# Altium project W5100S-PICO-Mining.PrjPcb
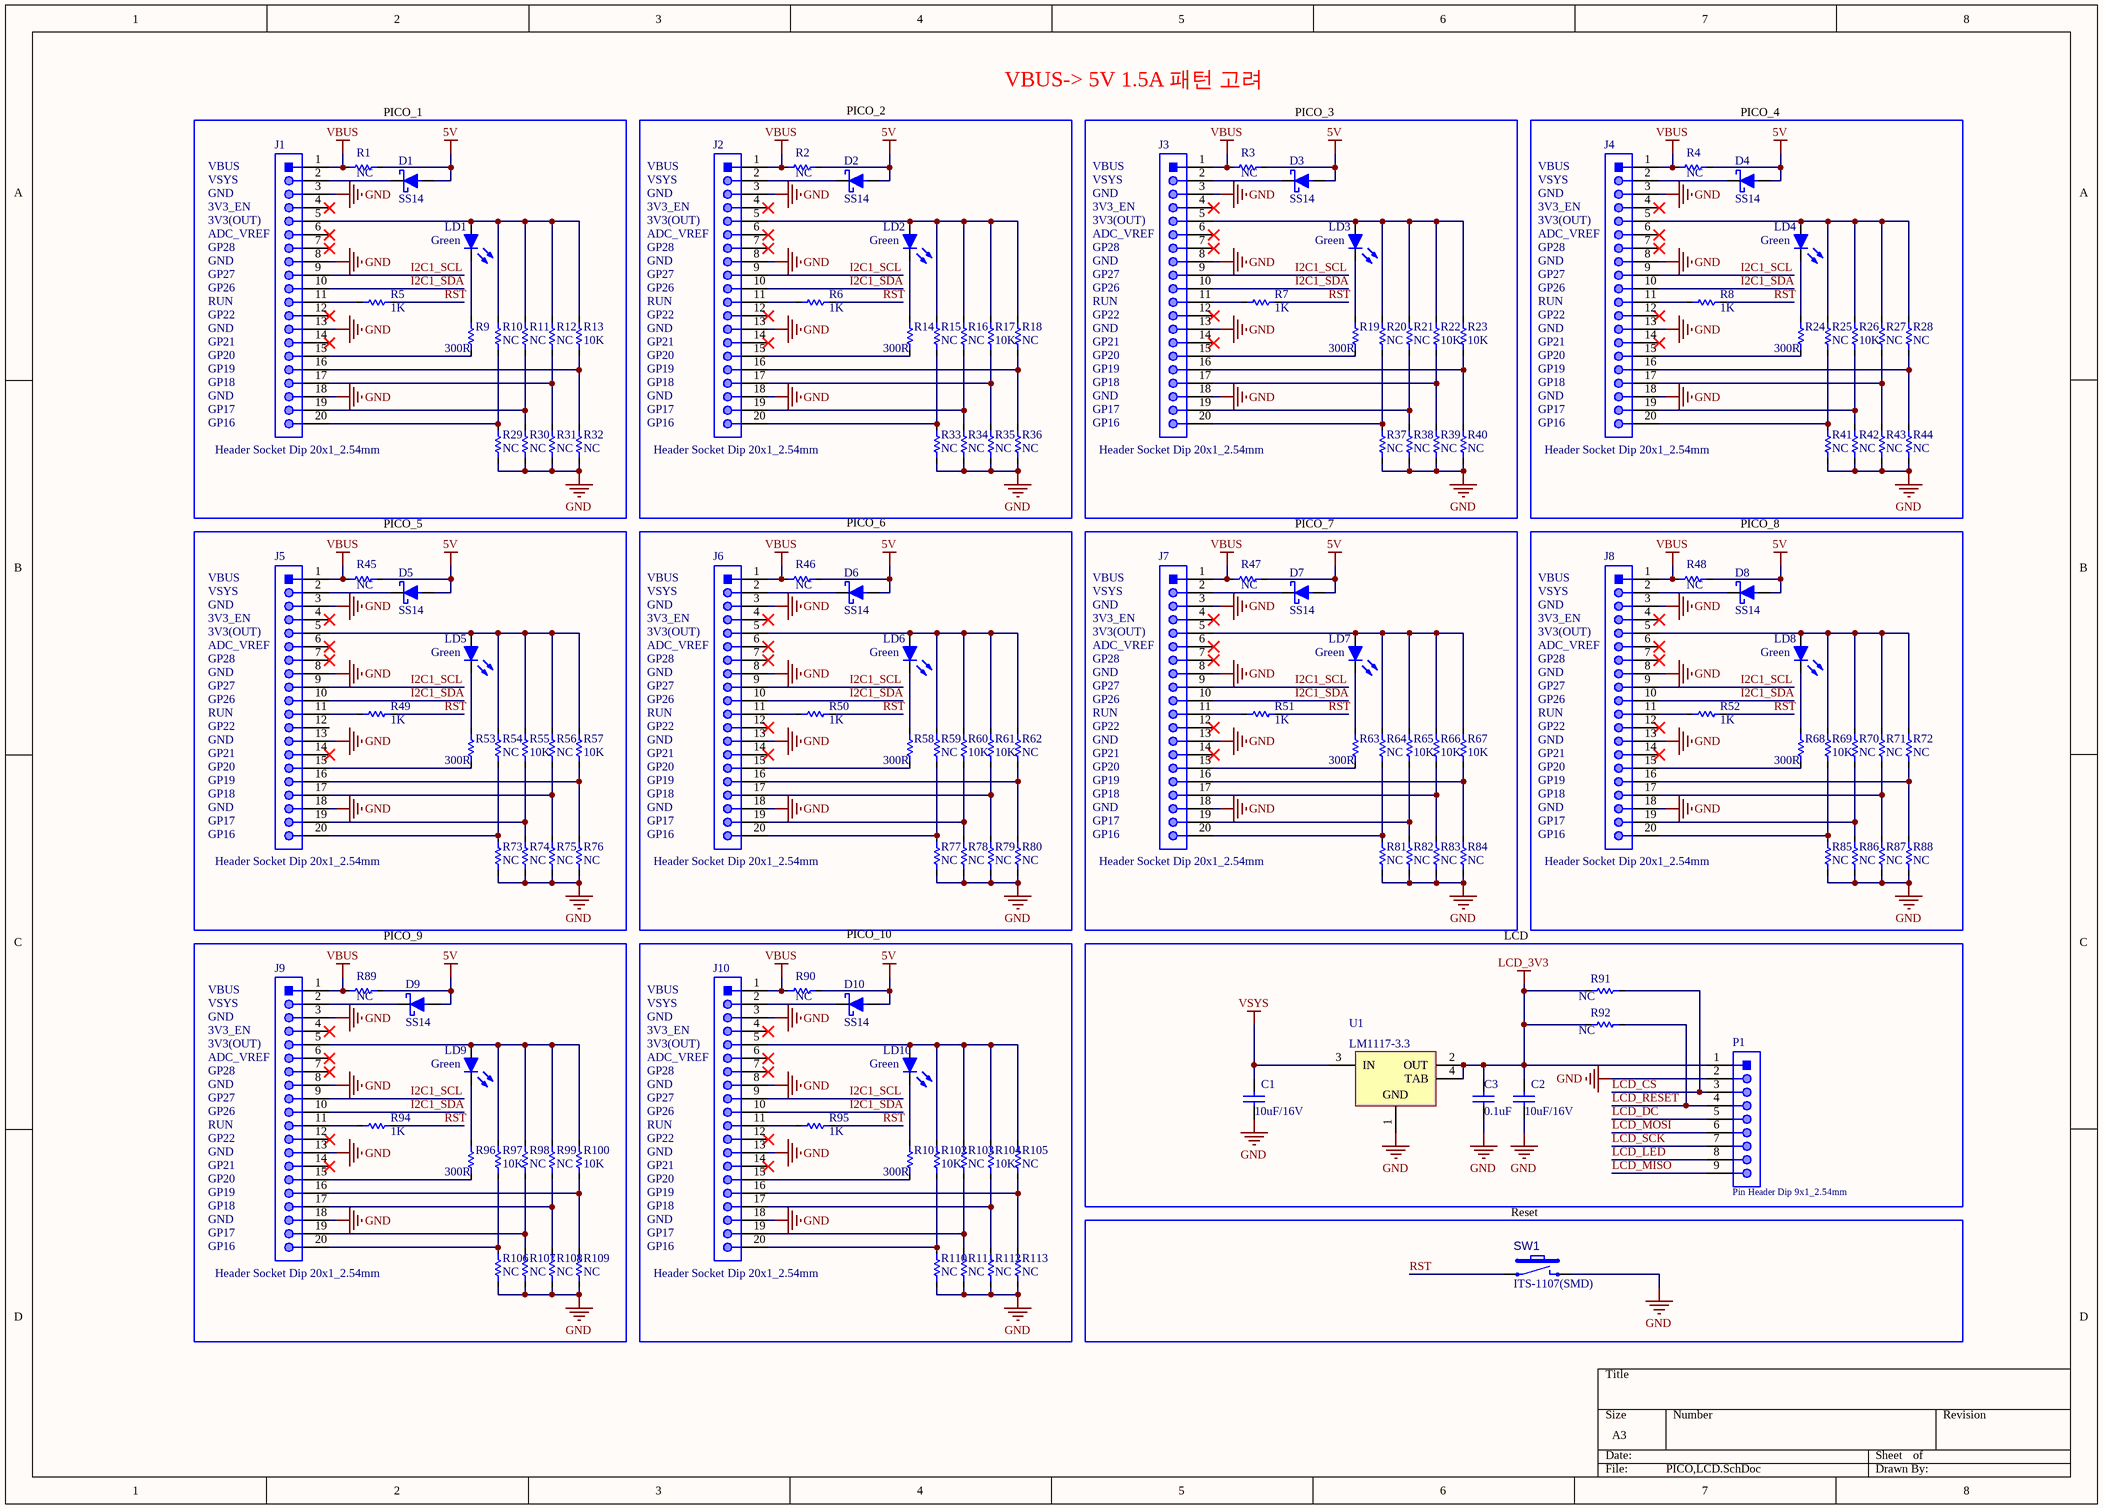
[diagram p0: PICO,LCD.SchDoc]
2 sheets, 224 parts. Net scope: global (net labels, ports and power ports of the same name join across sheets).
Board file: W5100S-PICO-Mining_V100.PcbDoc
Sheets:
  PICO,LCD.SchDoc
  W5100S+POE.SchDoc

## Sheet PICO,LCD.SchDoc
size A3; SheetNumber: 1; SheetTotal: 2

### Parts
C1  10uF/16V  [CAP-0805]
C2  10uF/16V  [CAP-0805]
C3  0.1uF  [CAP-0603]
D1  SS14  [DO-214AC/SMA]
D2  SS14  [DO-214AC/SMA]
D3  SS14  [DO-214AC/SMA]
D4  SS14  [DO-214AC/SMA]
D5  SS14  [DO-214AC/SMA]
D6  SS14  [DO-214AC/SMA]
D7  SS14  [DO-214AC/SMA]
D8  SS14  [DO-214AC/SMA]
D9  SS14  [DO-214AC/SMA]
D10  SS14  [DO-214AC/SMA]
J1  Header Socket Dip 20x1_2.54mm  [IDC-1X20(SOCKET)]
J2  Header Socket Dip 20x1_2.54mm  [IDC-1X20(SOCKET)]
J3  Header Socket Dip 20x1_2.54mm  [IDC-1X20(SOCKET)]
J4  Header Socket Dip 20x1_2.54mm  [IDC-1X20(SOCKET)]
J5  Header Socket Dip 20x1_2.54mm  [IDC-1X20(SOCKET)]
J6  Header Socket Dip 20x1_2.54mm  [IDC-1X20(SOCKET)]
J7  Header Socket Dip 20x1_2.54mm  [IDC-1X20(SOCKET)]
J8  Header Socket Dip 20x1_2.54mm  [IDC-1X20(SOCKET)]
J9  Header Socket Dip 20x1_2.54mm  [IDC-1X20(SOCKET)]
J10  Header Socket Dip 20x1_2.54mm  [IDC-1X20(SOCKET)]
LD1  Green  [LED-0603-GREEN]
LD2  Green  [LED-0603-GREEN]
LD3  Green  [LED-0603-GREEN]
LD4  Green  [LED-0603-GREEN]
LD5  Green  [LED-0603-GREEN]
LD6  Green  [LED-0603-GREEN]
LD7  Green  [LED-0603-GREEN]
LD8  Green  [LED-0603-GREEN]
LD9  Green  [LED-0603-GREEN]
LD10  Green  [LED-0603-GREEN]
P1  Pin Header Dip 9x1_2.54mm  [LCD(PIN HEADER9X1_2.54)]
R1  NC  [RES-0603]
R2  NC  [RES-0603]
R3  NC  [RES-0603]
R4  NC  [RES-0603]
R5  1K  [RES-0603]
R6  1K  [RES-0603]
R7  1K  [RES-0603]
R8  1K  [RES-0603]
R9  300R  [RES-0603]
R10  NC  [RES-0603]
R11  NC  [RES-0603]
R12  NC  [RES-0603]
R13  10K  [RES-0603]
R14  300R  [RES-0603]
R15  NC  [RES-0603]
R16  NC  [RES-0603]
R17  10K  [RES-0603]
R18  NC  [RES-0603]
R19  300R  [RES-0603]
R20  NC  [RES-0603]
R21  NC  [RES-0603]
R22  10K  [RES-0603]
R23  10K  [RES-0603]
R24  300R  [RES-0603]
R25  NC  [RES-0603]
R26  10K  [RES-0603]
R27  NC  [RES-0603]
R28  NC  [RES-0603]
R29  NC  [RES-0603]
R30  NC  [RES-0603]
R31  NC  [RES-0603]
R32  NC  [RES-0603]
R33  NC  [RES-0603]
R34  NC  [RES-0603]
R35  NC  [RES-0603]
R36  NC  [RES-0603]
R37  NC  [RES-0603]
R38  NC  [RES-0603]
R39  NC  [RES-0603]
R40  NC  [RES-0603]
R41  NC  [RES-0603]
R42  NC  [RES-0603]
R43  NC  [RES-0603]
R44  NC  [RES-0603]
R45  NC  [RES-0603]
R46  NC  [RES-0603]
R47  NC  [RES-0603]
R48  NC  [RES-0603]
R49  1K  [RES-0603]
R50  1K  [RES-0603]
R51  1K  [RES-0603]
R52  1K  [RES-0603]
R53  300R  [RES-0603]
R54  NC  [RES-0603]
R55  10K  [RES-0603]
R56  NC  [RES-0603]
R57  10K  [RES-0603]
R58  300R  [RES-0603]
R59  NC  [RES-0603]
R60  10K  [RES-0603]
R61  10K  [RES-0603]
R62  NC  [RES-0603]
R63  300R  [RES-0603]
R64  NC  [RES-0603]
R65  10K  [RES-0603]
R66  10K  [RES-0603]
R67  10K  [RES-0603]
R68  300R  [RES-0603]
R69  10K  [RES-0603]
R70  NC  [RES-0603]
R71  NC  [RES-0603]
R72  NC  [RES-0603]
R73  NC  [RES-0603]
R74  NC  [RES-0603]
R75  NC  [RES-0603]
R76  NC  [RES-0603]
R77  NC  [RES-0603]
R78  NC  [RES-0603]
R79  NC  [RES-0603]
R80  NC  [RES-0603]
R81  NC  [RES-0603]
R82  NC  [RES-0603]
R83  NC  [RES-0603]
R84  NC  [RES-0603]
R85  NC  [RES-0603]
R86  NC  [RES-0603]
R87  NC  [RES-0603]
R88  NC  [RES-0603]
R89  NC  [RES-0603]
R90  NC  [RES-0603]
R91  NC  [RES-0603]
R92  NC  [RES-0603]
R94  1K  [RES-0603]
R95  1K  [RES-0603]
R96  300R  [RES-0603]
R97  10K  [RES-0603]
R98  NC  [RES-0603]
R99  NC  [RES-0603]
R100  10K  [RES-0603]
R101  300R  [RES-0603]
R102  10K  [RES-0603]
R103  NC  [RES-0603]
R104  10K  [RES-0603]
R105  NC  [RES-0603]
R106  NC  [RES-0603]
R107  NC  [RES-0603]
R108  NC  [RES-0603]
R109  NC  [RES-0603]
R110  NC  [RES-0603]
R111  NC  [RES-0603]
R112  NC  [RES-0603]
R113  NC  [RES-0603]
SW1  ITS-1107(SMD)  [IT-1107(SMD)]
U1  LM1117-3.3  [SOT-223]

### Blocks framed on the sheet
LCD: C1-C3 P1 R91 R92 U1
Reset: SW1

### Nets
5V: D1.1(A) D2.1(A) D3.1(A) D4.1(A) D5.1(A) D6.1(A) D7.1(A) D8.1(A) D9.1(A) D10.1(A) R1.1 R2.1 R3.1 R4.1 R45.1 R46.1 R47.1 R48.1 R89.1 R90.1
GND: C1.1 C2.1 C3.1 J1.3 J1.8 J1.13 J1.18 J2.3 J2.8 J2.13 J2.18 J3.3 J3.8 J3.13 J3.18 J4.3 J4.8 J4.13 J4.18 J5.3 J5.8 J5.13 J5.18 J6.3 J6.8 J6.13 J6.18 J7.3 J7.8 J7.13 J7.18 J8.3 J8.8 J8.13 J8.18 J9.3 J9.8 J9.13 J9.18 J10.3 J10.8 J10.13 J10.18 P1.2 R29.1 R30.1 R31.1 R32.1 R33.1 R34.1 R35.1 R36.1 R37.1 R38.1 R39.1 R40.1 R41.1 R42.1 R43.1 R44.1 R73.1 R74.1 R75.1 R76.1 R77.1 R78.1 R79.1 R80.1 R81.1 R82.1 R83.1 R84.1 R85.1 R86.1 R87.1 R88.1 R106.1 R107.1 R108.1 R109.1 R110.1 R111.1 R112.1 R113.1 SW1.2 U1.1(GND)
LCD_3V3: C2.2 C3.2 P1.1 R91.2 R92.2 U1.2(OUT) U1.4(TAB)
VBUS: J1.1 J2.1 J3.1 J4.1 J5.1 J6.1 J7.1 J8.1 J9.1 J10.1 R1.2 R2.2 R3.2 R4.2 R45.2 R46.2 R47.2 R48.2 R89.2 R90.2
VSYS: C1.2 U1.3(IN)
I2C1_SCL: J1.9 J2.9 J3.9 J4.9 J5.9 J6.9 J7.9 J8.9 J9.9 J10.9  [project net GPIO27/ADC1]
I2C1_SDA: J1.10 J2.10 J3.10 J4.10 J5.10 J6.10 J7.10 J8.10 J9.10 J10.10  [project net GPIO26/ADC0]
LCD_CS: P1.3 R91.1  [project net GPIO13]
LCD_DC: P1.5  [project net GPIO14]
LCD_LED: P1.8  [project net GPIO5]
LCD_MISO: P1.9  [project net GPIO12]
LCD_MOSI: P1.6  [project net GPIO11]
LCD_RESET: P1.4 R92.1  [project net GPIO15]
LCD_SCK: P1.7  [project net GPIO10]
RST: R5.1 R6.1 R7.1 R8.1 R49.1 R50.1 R51.1 R52.1 R94.1 R95.1 SW1.1
NetD1_2: D1.2(C) J1.2
NetD2_2: D2.2(C) J2.2
NetD3_2: D3.2(C) J3.2
NetD4_2: D4.2(C) J4.2
NetD5_2: D5.2(C) J5.2
NetD6_2: D6.2(C) J6.2
NetD7_2: D7.2(C) J7.2
NetD8_2: D8.2(C) J8.2
NetD9_2: D9.2(C) J9.2
NetD10_2: D10.2(C) J10.2
NetJ1_5: J1.5 LD1.1(A) R10.2 R11.2 R12.2 R13.2
NetJ1_11: J1.11 R5.2
NetJ1_15: J1.15 R9.2
NetJ1_16: J1.16 R13.1 R32.2
NetJ1_17: J1.17 R12.1 R31.2
NetJ1_19: J1.19 R11.1 R30.2
NetJ1_20: J1.20 R10.1 R29.2
NetJ2_5: J2.5 LD2.1(A) R15.2 R16.2 R17.2 R18.2
NetJ2_11: J2.11 R6.2
NetJ2_15: J2.15 R14.2
NetJ2_16: J2.16 R18.1 R36.2
NetJ2_17: J2.17 R17.1 R35.2
NetJ2_19: J2.19 R16.1 R34.2
NetJ2_20: J2.20 R15.1 R33.2
NetJ3_5: J3.5 LD3.1(A) R20.2 R21.2 R22.2 R23.2
NetJ3_11: J3.11 R7.2
NetJ3_15: J3.15 R19.2
NetJ3_16: J3.16 R23.1 R40.2
NetJ3_17: J3.17 R22.1 R39.2
NetJ3_19: J3.19 R21.1 R38.2
NetJ3_20: J3.20 R20.1 R37.2
NetJ4_5: J4.5 LD4.1(A) R25.2 R26.2 R27.2 R28.2
NetJ4_11: J4.11 R8.2
NetJ4_15: J4.15 R24.2
NetJ4_16: J4.16 R28.1 R44.2
NetJ4_17: J4.17 R27.1 R43.2
NetJ4_19: J4.19 R26.1 R42.2
NetJ4_20: J4.20 R25.1 R41.2
NetJ5_5: J5.5 LD5.1(A) R54.2 R55.2 R56.2 R57.2
NetJ5_11: J5.11 R49.2
NetJ5_15: J5.15 R53.2
NetJ5_16: J5.16 R57.1 R76.2
NetJ5_17: J5.17 R56.1 R75.2
NetJ5_19: J5.19 R55.1 R74.2
NetJ5_20: J5.20 R54.1 R73.2
NetJ6_5: J6.5 LD6.1(A) R59.2 R60.2 R61.2 R62.2
NetJ6_11: J6.11 R50.2
NetJ6_15: J6.15 R58.2
NetJ6_16: J6.16 R62.1 R80.2
NetJ6_17: J6.17 R61.1 R79.2
NetJ6_19: J6.19 R60.1 R78.2
NetJ6_20: J6.20 R59.1 R77.2
NetJ7_5: J7.5 LD7.1(A) R64.2 R65.2 R66.2 R67.2
NetJ7_11: J7.11 R51.2
NetJ7_15: J7.15 R63.2
NetJ7_16: J7.16 R67.1 R84.2
NetJ7_17: J7.17 R66.1 R83.2
NetJ7_19: J7.19 R65.1 R82.2
NetJ7_20: J7.20 R64.1 R81.2
NetJ8_5: J8.5 LD8.1(A) R69.2 R70.2 R71.2 R72.2
NetJ8_11: J8.11 R52.2
NetJ8_15: J8.15 R68.2
NetJ8_16: J8.16 R72.1 R88.2
NetJ8_17: J8.17 R71.1 R87.2
NetJ8_19: J8.19 R70.1 R86.2
NetJ8_20: J8.20 R69.1 R85.2
NetJ9_5: J9.5 LD9.1(A) R97.2 R98.2 R99.2 R100.2
NetJ9_11: J9.11 R94.2
NetJ9_15: J9.15 R96.2
NetJ9_16: J9.16 R100.1 R109.2
NetJ9_17: J9.17 R99.1 R108.2
NetJ9_19: J9.19 R98.1 R107.2
NetJ9_20: J9.20 R97.1 R106.2
NetJ10_5: J10.5 LD10.1(A) R102.2 R103.2 R104.2 R105.2
NetJ10_11: J10.11 R95.2
NetJ10_15: J10.15 R101.2
NetJ10_16: J10.16 R105.1 R113.2
NetJ10_17: J10.17 R104.1 R112.2
NetJ10_19: J10.19 R103.1 R111.2
NetJ10_20: J10.20 R102.1 R110.2
NetLD1_2: LD1.2(K) R9.1
NetLD2_2: LD2.2(K) R14.1
NetLD3_2: LD3.2(K) R19.1
NetLD4_2: LD4.2(K) R24.1
NetLD5_2: LD5.2(K) R53.1
NetLD6_2: LD6.2(K) R58.1
NetLD7_2: LD7.2(K) R63.1
NetLD8_2: LD8.2(K) R68.1
NetLD9_2: LD9.2(K) R96.1
NetLD10_2: LD10.2(K) R101.1

Not connected (* = marked no-connect by the designer): J1 4* 6* 7* 12* 14*; J2 4* 6* 7* 12* 14*; J3 4* 6* 7* 12* 14*; J4 4* 6* 7* 12* 14*; J5 4* 6* 7* 12 14*; J6 4* 6* 7* 12* 14*; J7 4* 6* 7* 12* 14*; J8 4* 6* 7* 12* 14*; J9 4* 6* 7* 12* 14*; J10 4* 6* 7* 12* 14*

### Notes on the sheet
- PICO_2
- VBUS-> 5V 1.5A 패턴 고려
- VBUS
- VSYS
- PICO_1
- PICO_3
- PICO_4
- GND
- 3V3_EN
- (near J1) 3V3(OUT)
- (near J1) ADC_VREF
- (near J2) 3V3(OUT)
- (near J2) ADC_VREF
- (near J3) 3V3(OUT)
- (near J3) ADC_VREF
- (near J4) 3V3(OUT)
- (near J4) ADC_VREF
- GP28
- GP27
- GP26
- RUN
- GP22
- GP21
- GP20
- GP19
- GP18
- GP17
- GP16
- PICO_5
- PICO_6
- PICO_7
- PICO_8
- (near J5) 3V3(OUT)
- (near J5) ADC_VREF
- (near J6) 3V3(OUT)
- (near J6) ADC_VREF
- (near J7) 3V3(OUT)
- (near J7) ADC_VREF
- (near J8) 3V3(OUT)
- (near J8) ADC_VREF
- PICO_9
- PICO_10
- (near J9) 3V3(OUT)
- (near J10) 3V3(OUT)
- (near J9) ADC_VREF
- (near J10) ADC_VREF

### Library data of the parts
C1 C2 = CAP-0805: MLCC-0805(2012)
C3 = CAP-0603: MLCC-0603(1608)
D1-D10 = DIODE-Shottky SMA(DO-214AC): DIODE SCHOTTKY 40V 1A SMA; Manufacturer: ON Semiconductor; Peak Reverse Current: 0.2mA; Max Junction Temp: +125°C; Standoff Height: 0.05mm; Max Surge Forward Current: 40A; Mouser Description: Schottky Diodes & Rectifiers SMA 40V 1.0A; RoHS: TRUE; Lead Free: Yes; Manufacturer Part Number: SS14; Device Class L3: Schottky Diodes; Category: Diode; Automotive: No; Digikey Description: DIODE SCHOTTKY 40V 1A SMA; ComponentLink2Description: Datasheet; Device Class L2: Diodes; Height: 2.5mm; Temperature Range High: +125°C; ComponentLink2URL: https://www.onsemi.com/pub/Collateral/SS19-D.PDF; Device Class L1: Discrete Semiconductors; Package: 403AE; Octopart: https://octopart.com/ss14-on+semiconductor-29205033; Max Repetitive Reverse Voltage: 40V; Temperature Range Low: -65°C; Forward Current: 1A; Temperature: -65°C to +125°C
J1-J10 = Header Socket 20x1_2.54mm: THT Vertical Header Socket WR-PHD, Pitch 2.54 mm, Single Row, 20 pins; Manufacturer_Name: Harwin; Manufacturer_Part_Number: M20-7822046; Datasheet Link: https://www.harwin.com/products/M20-7822046/; Height: 8.65mm; Mouser Part Number: 855-M20-7822046; Mouser Price/Stock: https://www.mouser.co.uk/ProductDetail/Harwin/M20-7822046?qs=ulE8k0yEMYayyds2fKN7wQ%3D%3D
LD1-LD10 = GREEN LED-0603: LED-0603
P1 = Pin Header 9x1_2.54mm: THT Vertical Pin Header WR-PHD, Pitch 2.54 mm, Single Row, 9 pins; Part Number: 61300911121; Manufacturer: Wurth Elektronik; Pitch: 2.54mm; Gender: Male; Working Voltage: 250VAC; Contact Resistance: 20mOhm; Withstanding Voltage: 500VAC; Pin Number: 9; Rated Current: 3A; Package Reference: 61300911121; Mounting Technology: THT; Publisher: WurthElektronik; Manufacturer URL: http://www.we-online.de; Orientation: Vertical; Datasheet URL: https://katalog.we-online.de/em/datasheet/6130xx11121.pdf; Operating Temperature: -40to105degC; Row Number: Single; Packaging: Bag
R1-R92 R94-R113 = RES-0603: Chip Resistor 0603(1608); Manufacturer: Yageo; Power Rating: 100mW; Voltage Rating: 50V; Tolerance: 1%; Temperature Coefficient: 100ppm/degreesC; Resistance: 1.5KOhm; Military Standard: Not; Datasheet URL: http://www.yageo.com/NewPortal/yageodocoutput?fileName=/pdf/R-Chip/PYu-RC_Group_51_RoHS_L_5.pdf; Package Description: 2-Pin Surface Mount Device, Body 1.6 x 0.8 mm; Composition: ThickFilm; Case Code (Metric): 1608; Case/Package: 0603; Number of Terminations: 2; Depth: 0.8mm; Height: 0.022inch; Manufacturer URL: http://www.yageo.com/; Lead Free: LeadFree; Min Operating Temperature: -55degC; Max Operating Temperature: 155degC; Datasheet Version: Rev. 5, 10/2016; RoHSCompliant: true; Max Power Dissipation: 100mW; Packaging: TapeandReel; Voltage Rating (DC): 50V; Length: 0.063inch; Width: 0.031inch; Number of Pins: 2; Termination: SMD/SMT; Package Reference: 0603; Package Quantity: 1; Case Code (Imperial): 0603; REACH SVHC: NoSVHC
SW1 = ITS-1107(SMD): TACT Switch (SMD)
U1 = LM1117: 800mA Low-Dropout Linear Regulator, 4-pin SOT-223, Pb-Free; PartNumber: LM1117IMP-3.3/NOPB; Manufacturer: Texas Instruments; PackageTopMarking: XYTT*N05B; PowerWise: N; High-Reliability: Y; CompType: LDO IC; Code_IPC: SOT223-4; PackageReference: DCY0004A; PinCount: 4; PackageDescription: Molded SOT-223, 6.50 x 3.56 x 1.6mm Body, 4 Lead, 2.3mm Pitch; RoHS: Y; ComponentLink1Description: Datasheet URL; Code_JEDEC: TO-261-AA; ComponentLink1URL: http://www.ti.com/general/docs/lit/getliterature.tsp?genericPartNumber=LM1117-N&fileType=pdf

## Sheet W5100S+POE.SchDoc
size A3; SheetNumber: 2; SheetTotal: 2
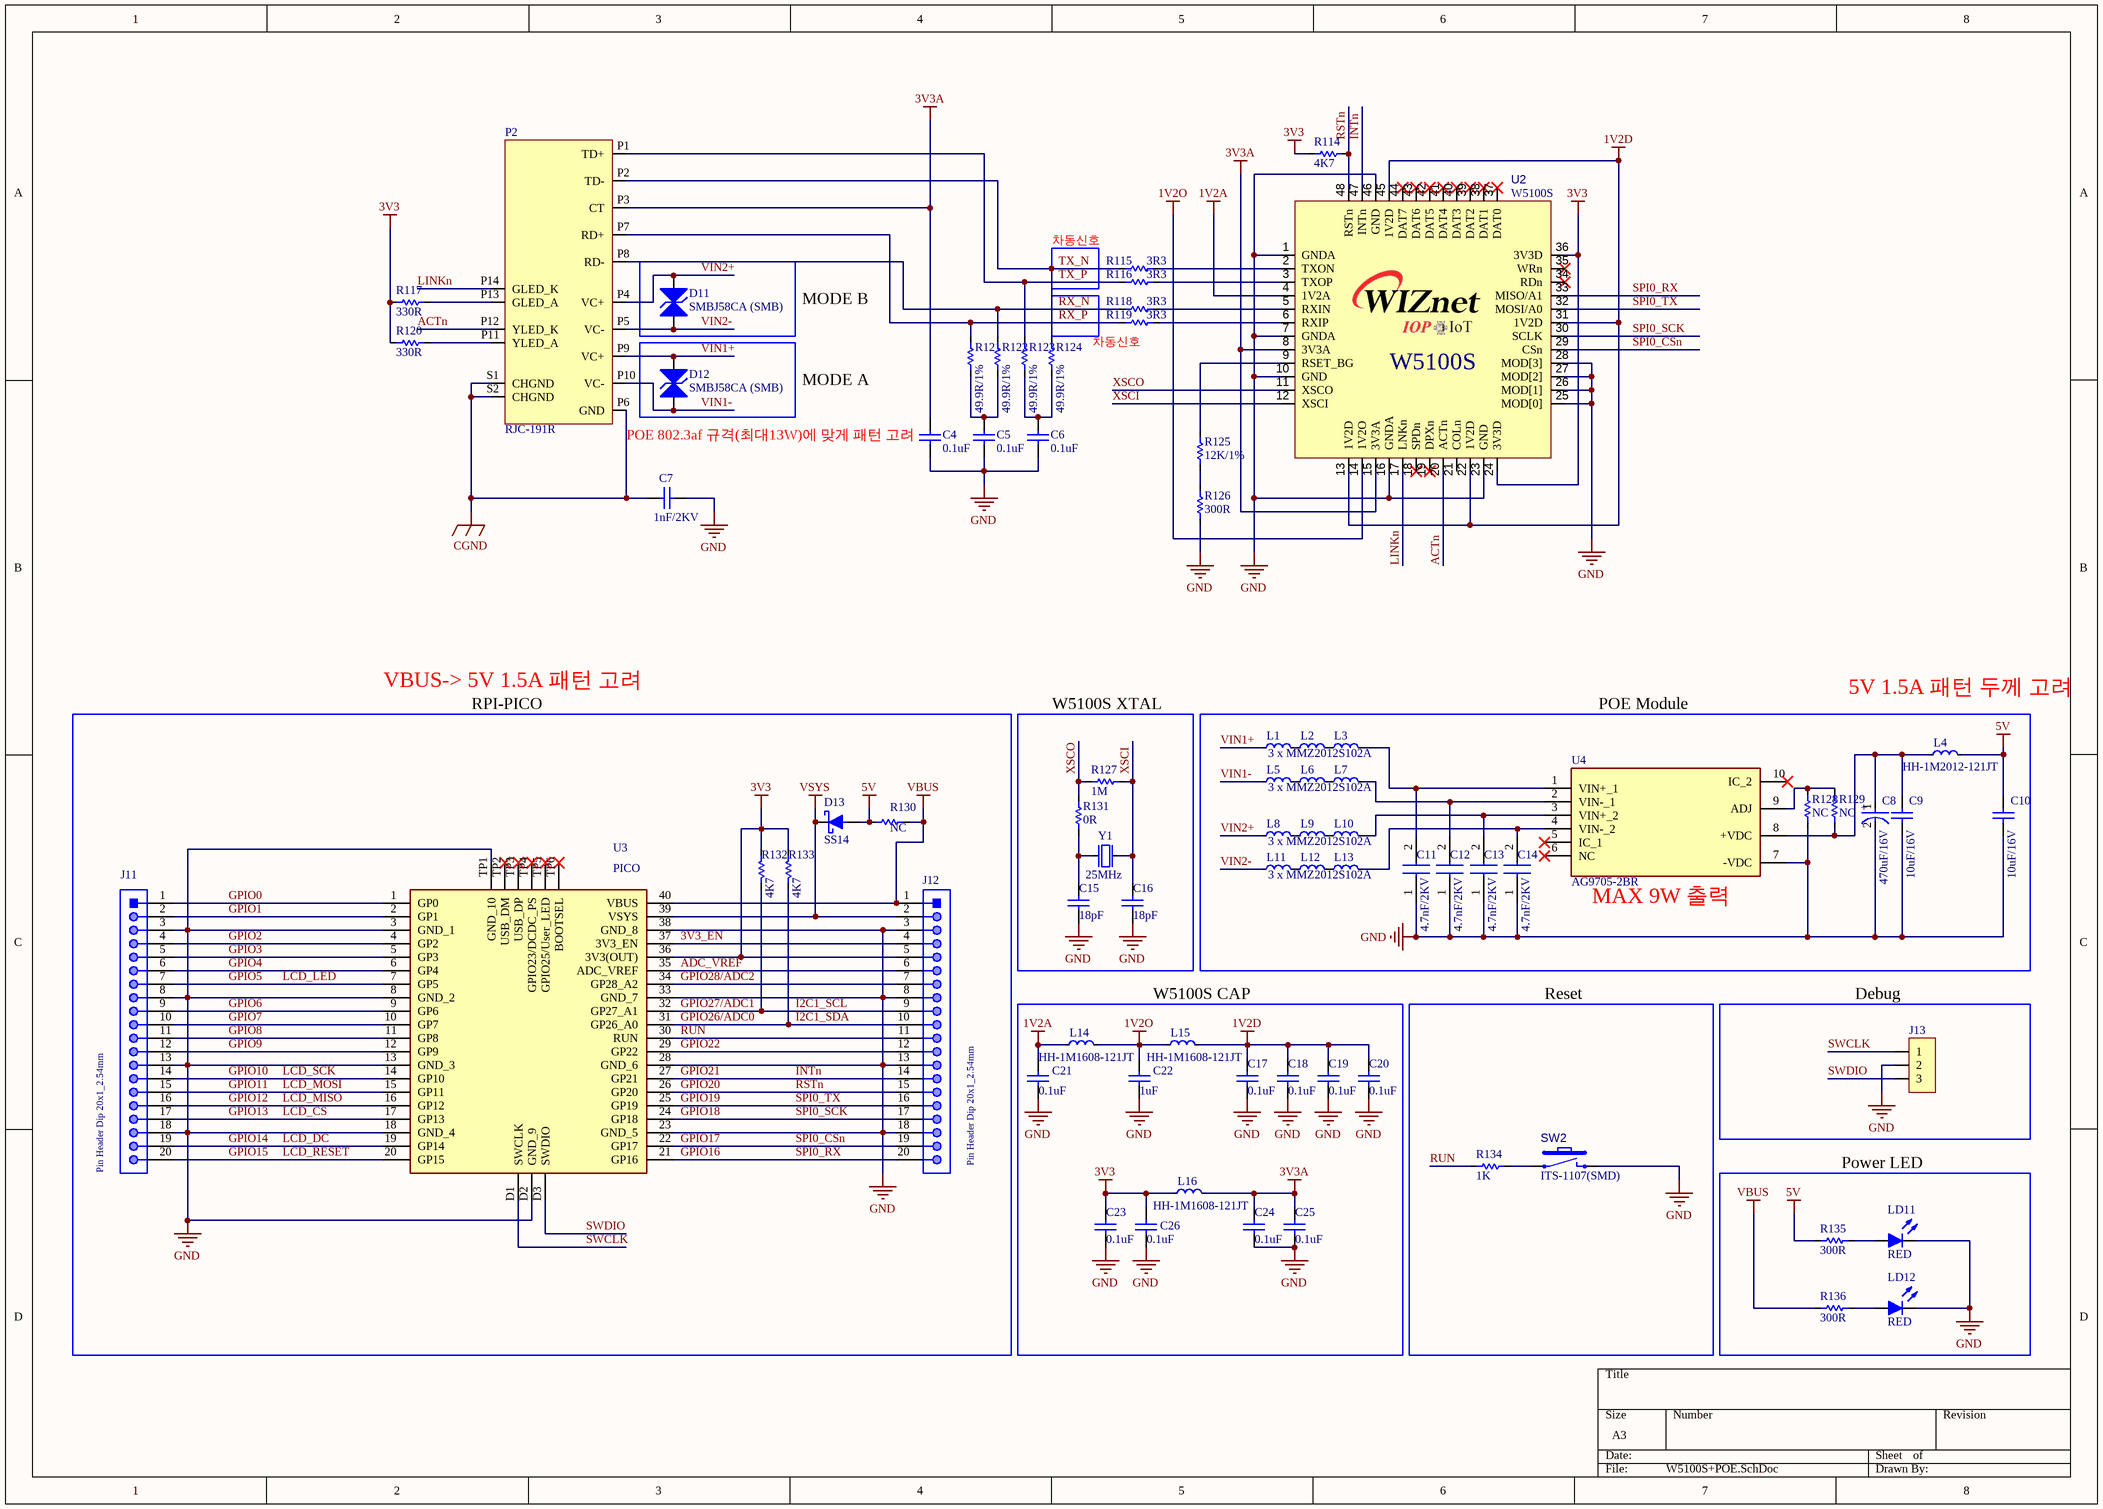
[diagram p1: W5100S+POE.SchDoc]

### Parts
C4  0.1uF  [CAP-0603]
C5  0.1uF  [CAP-0603]
C6  0.1uF  [CAP-0603]
C7  1nF/2KV  [CAP-1808]
C8  470uF/16V  [CAP-8.3EC]
C9  10uF/16V  [CAP-0805]
C10  10uF/16V  [CAP-0805]
C11  4.7nF/2KV  [CK45-E3DD472ZYGNA]
C12  4.7nF/2KV  [CK45-E3DD472ZYGNA]
C13  4.7nF/2KV  [CK45-E3DD472ZYGNA]
C14  4.7nF/2KV  [CK45-E3DD472ZYGNA]
C15  18pF  [CAP-0603]
C16  18pF  [CAP-0603]
C17  0.1uF  [CAP-0603]
C18  0.1uF  [CAP-0603]
C19  0.1uF  [CAP-0603]
C20  0.1uF  [CAP-0603]
C21  0.1uF  [CAP-0603]
C22  1uF  [CAP-0603]
C23  0.1uF  [CAP-0603]
C24  0.1uF  [CAP-0603]
C25  0.1uF  [CAP-0603]
C26  0.1uF  [CAP-0603]
D11  SMBJ58CA (SMB)  [DO-214AA/SMB(TVS)]
D12  SMBJ58CA (SMB)  [DO-214AA/SMB(TVS)]
D13  SS14  [DO-214AC/SMA]
J11  Pin Header Dip 20x1_2.54mm  [IDC-1X20]
J12  Pin Header Dip 20x1_2.54mm  [IDC-1X20]
J13  2.54mm 1x3 Pin Header DIP  [idc-1x3]  (value not drawn)
L1  IND-0805  [IND-0805]  (value not drawn)
L2  IND-0805  [IND-0805]  (value not drawn)
L3  IND-0805  [IND-0805]  (value not drawn)
L4  HH-1M2012-121JT  [IND-0805]
L5  IND-0805  [IND-0805]  (value not drawn)
L6  IND-0805  [IND-0805]  (value not drawn)
L7  IND-0805  [IND-0805]  (value not drawn)
L8  IND-0805  [IND-0805]  (value not drawn)
L9  IND-0805  [IND-0805]  (value not drawn)
L10  IND-0805  [IND-0805]  (value not drawn)
L11  IND-0805  [IND-0805]  (value not drawn)
L12  IND-0805  [IND-0805]  (value not drawn)
L13  IND-0805  [IND-0805]  (value not drawn)
L14  HH-1M1608-121JT  [IND-0603]
L15  HH-1M1608-121JT  [IND-0603]
L16  HH-1M1608-121JT  [IND-0603]
LD11  RED  [LED-0603-RED]
LD12  RED  [LED-0603-RED]
P2  RJC-191R  [RJC-191R]
R114  4K7  [RES-0603]
R115  3R3  [RES-0603]
R116  3R3  [RES-0603]
R117  330R  [RES-0603]
R118  3R3  [RES-0603]
R119  3R3  [RES-0603]
R120  330R  [RES-0603]
R121  49.9R/1%  [RES-0603]
R122  49.9R/1%  [RES-0603]
R123  49.9R/1%  [RES-0603]
R124  49.9R/1%  [RES-0603]
R125  12K/1%  [RES-0603]
R126  300R  [RES-0603]
R127  1M  [RES-0603]
R128  NC  [RES-0603]
R129  NC  [RES-0603]
R130  NC  [RES-0603]
R131  0R  [RES-0603]
R132  4K7  [RES-0603]
R133  4K7  [RES-0603]
R134  1K  [RES-0603]
R135  300R  [RES-0603]
R136  300R  [RES-0603]
SW2  ITS-1107(SMD)  [IT-1107(SMD)]
U2  W5100S  [LQFP48(0.5/9.0)]
U3  PICO  [PICO]
U4  AG9705-2BR  [AG9705-2BR]
Y1  25MHz  [OSC-82J0626]

### Blocks framed on the sheet
RPI-PICO: D13 J11 J12 R130 R132 R133 U3
W5100S XTAL: C15 C16 R127 R131 Y1
W5100S CAP: C17-C26 L14-L16
Reset: R134 SW2
Debug: J13
Power LED: LD11 LD12 R135 R136

### Nets
1V2A: C21.2 L14.1 U2.4(1V2A)
1V2D: C17.2 C18.2 C19.2 C20.2 L15.2 U2.13(1V2D) U2.22(1V2D) U2.31(1V2D) U2.45(1V2D)
1V2O: C22.2 L14.2 L15.1 U2.14(1V2O)
3V3: C23.2 C26.2 J12.5 L16.1 R114.1 R117.1 R120.2 R132.2 R133.2 U2.24(3V3D) U2.36(3V3D) U3.36(3V3(OUT))
3V3A: C4.2 C24.2 C25.2 L16.2 P2.P3(CT) U2.8(3V3A) U2.15(3V3A)
5V: C10.2 D13.1(A) L4.2 R130.1 R135.1
CGND: C7.1 P2.P6(GND) P2.S1(CHGND) P2.S2(CHGND)
GND: C4.1 C5.1 C6.1 C7.2 C8.2(C) C9.1 C10.1 C11.1 C12.1 C13.1 C14.1 C15.1 C16.1 C17.1 C18.1 C19.1 C20.1 C21.1 C22.1 C23.1 C24.1 C25.1 C26.1 J11.3 J11.8 J11.13 J11.18 J12.3 J12.8 J12.13 J12.18 J13.2 LD11.2(K) LD12.2(K) R126.2 R128.2 SW2.2 U2.1(GNDA) U2.7(GNDA) U2.10(GND) U2.16(GNDA) U2.23(GND) U2.25(MOD[0]) U2.26(MOD[1]) U2.27(MOD[2]) U2.28(MOD[3]) U2.46(GND) U3.3(GND_1) U3.8(GND_2) U3.13(GND_3) U3.18(GND_4) U3.23(GND_5) U3.28(GND_6) U3.33(GND_7) U3.38(GND_8) U3.D2(GND_9) U3.TP1(GND_10) U4.7(-VDC) Y1.2(GND) Y1.4(GND)
VBUS: J12.1 R130.2 R136.1 U3.40(VBUS)
VSYS: D13.2(C) J12.2 U3.39(VSYS)
3V3_EN: J12.4 U3.37(3V3_EN)
ACTn: P2.P12(YLED_K) U2.20(ACTn)
ADC_VREF: J12.6 U3.35(ADC_VREF)
GPIO0: J11.1 U3.1(GP0)
GPIO1: J11.2 U3.2(GP1)
GPIO2: J11.4 U3.4(GP2)
GPIO3: J11.5 U3.5(GP3)
GPIO4: J11.6 U3.6(GP4)
GPIO5: J11.7 U3.7(GP5)  [also labelled LCD_LED]
GPIO6: J11.9 U3.9(GP6)
GPIO7: J11.10 U3.10(GP7)
GPIO8: J11.11 U3.11(GP8)
GPIO9: J11.12 U3.12(GP9)
GPIO10: J11.14 U3.14(GP10)  [also labelled LCD_SCK]
GPIO11: J11.15 U3.15(GP11)  [also labelled LCD_MOSI]
GPIO12: J11.16 U3.16(GP12)  [also labelled LCD_MISO]
GPIO13: J11.17 U3.17(GP13)  [also labelled LCD_CS]
GPIO14: J11.19 U3.19(GP14)  [also labelled LCD_DC]
GPIO15: J11.20 U3.20(GP15)  [also labelled LCD_RESET]
GPIO16: J12.20 U2.33(MISO/A1) U3.21(GP16)  [also labelled SPI0_RX]
GPIO17: J12.19 U2.29(CSn) U3.22(GP17)  [also labelled SPI0_CSn]
GPIO18: J12.17 U2.30(SCLK) U3.24(GP18)  [also labelled SPI0_SCK]
GPIO19: J12.16 U2.32(MOSI/A0) U3.25(GP19)  [also labelled SPI0_TX]
GPIO20: J12.15 R114.2 U2.48(RSTn) U3.26(GP20)  [also labelled RSTn]
GPIO21: J12.14 U2.47(INTn) U3.27(GP21)  [also labelled INTn]
GPIO22: J12.12 U3.29(GP22)
GPIO26/ADC0: J12.10 R133.1 U3.31(GP26_A0)  [also labelled I2C1_SDA]
GPIO27/ADC1: J12.9 R132.1 U3.32(GP27_A1)  [also labelled I2C1_SCL]
GPIO28/ADC2: J12.7 U3.34(GP28_A2)
LINKn: P2.P14(GLED_K) U2.17(LNKn)
RUN: J12.11 R134.2 U3.30(RUN)
RX_N: P2.P8(RD-) R118.1 R122.2
RX_P: P2.P7(RD+) R119.1 R121.2
SWCLK: J13.1 U3.D1(SWCLK)
SWDIO: J13.3 U3.D3(SWDIO)
TX_N: P2.P2(TD-) R115.1 R124.2
TX_P: P2.P1(TD+) R116.1 R123.2
VIN1+: D12.2(A2) L1.1 P2.P9(VC+)
VIN1-: D12.1(A1) L5.1 P2.P10(VC-)
VIN2+: D11.2(A2) L8.1 P2.P4(VC+)
VIN2-: D11.1(A1) L11.1 P2.P5(VC-)
XSCI: C16.2 R127.1 U2.12(XSCI) Y1.3(out)
XSCO: R127.2 R131.2 U2.11(XSCO)
NetC5_2: C5.2 R121.1 R122.1
NetC6_2: C6.2 R123.1 R124.1
NetC8_1: C8.1(A) C9.2 L4.1 R129.1 U4.8(+VDC)
NetC11_2: C11.2 L3.2 U4.1(VIN+_1)
NetC12_2: C12.2 L7.2 U4.2(VIN-_1)
NetC13_2: C13.2 L10.2 U4.3(VIN+_2)
NetC14_2: C14.2 L13.2 U4.4(VIN-_2)
NetC15_2: C15.2 R131.1 Y1.1(inp)
NetL1_2: L1.2 L2.1
NetL2_2: L2.2 L3.1
NetL5_2: L5.2 L6.1
NetL6_2: L6.2 L7.1
NetL8_2: L8.2 L9.1
NetL9_2: L9.2 L10.1
NetL11_2: L11.2 L12.1
NetL12_2: L12.2 L13.1
NetLD11_1: LD11.1(A) R135.2
NetLD12_1: LD12.1(A) R136.2
NetP2_P11: P2.P11(YLED_A) R120.1
NetP2_P13: P2.P13(GLED_A) R117.2
NetR115_2: R115.2 U2.2(TXON)
NetR116_2: R116.2 U2.3(TXOP)
NetR118_2: R118.2 U2.5(RXIN)
NetR119_2: R119.2 U2.6(RXIP)
NetR125_1: R125.1 U2.9(RSET_BG)
NetR125_2: R125.2 R126.1
NetR128_1: R128.1 R129.2 U4.9(ADJ)
NetR134_1: R134.1 SW2.1

Not connected (* = marked no-connect by the designer): U2 18(SPDn)* 19(DPXn)* 21(COLn) 34(RDn)* 35(WRn)* 37(DAT0)* 38(DAT1)* 39(DAT2)* 40(DAT3)* 41(DAT4)* 42(DAT5)* 43(DAT6)* 44(DAT7)*; U3 TP2(USB_DM)* TP3(USB_DP)* TP4(GPIO23/DCDC_PS)* TP5(GPIO25/User_LED)* TP6(BOOTSEL)*; U4 5(IC_1)* 6(NC)* 10(IC_2)*

### Notes on the sheet
- 차동신호
- MODE B
- POE 802.3af 규격(최대13W)에 맞게 패턴 고려
- MODE A
- VBUS-> 5V 1.5A 패턴 고려
- POE Module
- 5V 1.5A 패턴 두께 고려
- 3 x MMZ2012S102A
- (near U4) MAX 9W 출력
- (in symbol AL-CAP-D 8.0mm_SMD) +

### Library data of the parts
C4-C6 C15-C26 = CAP-0603: MLCC-0603(1608)
C7 = CAP-1808: MLCC-1808(4520)
C8 = AL-CAP-D 8.0mm_SMD: AL-CAP D: 8.0mm SMD; Leakage Current: 1uA; Dissipation Factor: 6%; Dielectric Material: Tantalum; Voltage Rating: 10V; Polarity: Polar; Capacitance: 10uF; Life (Hours): 2000Hour; Tolerance: 20%; ESR (Equivalent Series Resistance): 4R; Number of Pins: 2; Package Quantity: 2000; Depth: 1.6mm; Radiation Hardening: No; Mount: Surface Mount; Case/Package: 1206; Features: General Purpose; Case Code (Imperial): 1206; Series: T491; Case Code (Metric): 3216; Height: 1.6mm; Voltage Rating (DC): 10V; Width: 0.063inch; Lead Pitch: 1.2mm; Length: 3.2mm; Height - Seated (Max): 0.071inch; Size: 1.6mm; Min Operating Temperature: -55°C; Packaging: Tape and Reel; Weight: 0.000571oz; Construction: Flat; Voltage: 10V; Termination: SMD/SMT; Max Operating Temperature: 125°C; Lead Free: Lead Free; REACH SVHC: No SVHC; RoHS Compliant: Yes
C9 C10 = CAP-0805: MLCC-0805(2012)
C11-C14 = Ceramic Disk Cap: Ceramic Disk Capacitor D: 10.5mm; Manufacturer_Name: TDK; Datasheet Link: https://product.tdk.com/system/files/dam/doc/product/capacitor/ceramic/lead-disc/catalog/leaddisc_commercial_ck45_en.pdf; Height: 14.5mm; Manufacturer_Part_Number: CK45-E3DD472ZYGNA; Mouser Part Number: 810-CK45-E3DD472ZYGN; Mouser Price/Stock: https://www.mouser.co.uk/ProductDetail/TDK/CK45-E3DD472ZYGNA?qs=eSfX1CQlHqqEDnRyEDuzfg%3D%3D
D11 D12 = DIODE-TVS (SMB): PartNumber: SMAJ58CA-E3/61; Manufacturer: Vishay Semiconductor; Manufacturer: Vishay Semiconductors; PPPM (W): 400, 300; ID (uA): 2; IFSM: 40 A; VWM (V): 58; VBR Bi-Directional (V): 6.4 to 231; Packing: Tape and Reel; ComponentLink1Description: Manufacturer URL; PackageDescription: 2-Pin DO-214AC (SMA), Body 4.245 x 2.665 mm; DatasheetVersion: 12/8/2013; ComponentLink2Description: Datasheet; ComponentLink2URL: http://www.vishay.com/docs/88390/smaj50a.pdf; ComponentLink3Description: Package Specification; ComponentLink3URL: http://www.vishay.com/docs/88390/smaj50a.pdf; Operating Junction and Storage Temperature Range: -55 to 150 degC; PackageReference: DO-214AC-2; RoHS: TRUE; ComponentLink1URL: http://www.vishay.com/; Mounting Technology: Surface Mount; Manufacturer Part Number: SMAJ58CA-E3/61
D13 = DIODE-Shottky SMA(DO-214AC): as D1 on sheet PICO,LCD; Mouser Description: Schottky Diodes & Rectifiers SMA 40V 1.0A; RoHS: TRUE; Lead Free: Yes; Manufacturer Part Number: SS14; Device Class L3: Schottky Diodes; Category: Diode; Automotive: No; Digikey Description: DIODE SCHOTTKY 40V 1A SMA; ComponentLink2Description: Datasheet; Device Class L2: Diodes; Height: 2.5mm; Temperature Range High: +125°C; ComponentLink2URL: https://www.onsemi.com/pub/Collateral/SS19-D.PDF; Device Class L1: Discrete Semiconductors; Package: 403AE; Octopart: https://octopart.com/ss14-on+semiconductor-29205033; Max Repetitive Reverse Voltage: 40V; Temperature Range Low: -65°C; Forward Current: 1A; Temperature: -65°C to +125°C
J11 J12 = Pin Header 20x1_2.54mm: THT Vertical Pin Header WR-PHD, Pitch 2.54 mm, Single Row, 20 pins; Manufacturer: Wurth Elektronik; Part Number: 61302011121; Withstanding Voltage: 500VAC; Gender: Male; Pin Number: 20; Rated Current: 3A; Contact Resistance: 20mOhm; Pitch: 2.54mm; Working Voltage: 250VAC; Publisher: WurthElektronik; Packaging: Bag; Datasheet URL: https://katalog.we-online.de/em/datasheet/6130xx11121.pdf; Row Number: Single; Mounting Technology: THT; Manufacturer URL: http://www.we-online.de; Orientation: Vertical; Package Reference: 61302011121; Operating Temperature: -40to105degC
L1-L13 = IND-0805: Inductor 0805(2012)
L14-L16 = IND-0603: Inductor 0603(1608)
LD11 LD12 = RED LED-0603: LED-0603
P2 = RJC-191R: PoE RJ45
R114-R136 = RES-0603: as R1 on sheet PICO,LCD; Military Standard: Not; Datasheet URL: http://www.yageo.com/NewPortal/yageodocoutput?fileName=/pdf/R-Chip/PYu-RC_Group_51_RoHS_L_5.pdf; Package Description: 2-Pin Surface Mount Device, Body 1.6 x 0.8 mm; Composition: ThickFilm; Case Code (Metric): 1608; Case/Package: 0603; Number of Terminations: 2; Depth: 0.8mm; Height: 0.022inch; Manufacturer URL: http://www.yageo.com/; Lead Free: LeadFree; Min Operating Temperature: -55degC; Max Operating Temperature: 155degC; Datasheet Version: Rev. 5, 10/2016; RoHSCompliant: true; Max Power Dissipation: 100mW; Packaging: TapeandReel; Voltage Rating (DC): 50V; Length: 0.063inch; Width: 0.031inch; Number of Pins: 2; Termination: SMD/SMT; Package Reference: 0603; Package Quantity: 1; Case Code (Imperial): 0603; REACH SVHC: NoSVHC
SW2 = ITS-1107(SMD): TACT Switch (SMD)
U2 = W5100S: WIZnet Hardwired TCP/IP Chip
U3 = PICO: Module; Manufacturer_Name: RASPBERRY-PI; Datasheet Link: https://datasheets.raspberrypi.org/pico/pico_datasheet.pdf; Height: 1mm; Manufacturer_Part_Number: PICO
U4 = AG9700: Integrated Circuit; Manufacturer_Name: Silvertel; Datasheet Link: http://silvertel.com/images/datasheets/Ag9700-Datasheet-low-cost-isolated-Power-over-Ethernet-PoE-module-solution.pdf; Height: 14mm; Manufacturer_Part_Number: AG9700
Y1 = OSC-82J0626-25MHz: X-tal 25MHz,3.2x2.5 SMD, CL=18pF

## Nets that join several sheets
5V: PICO,LCD (20 pins), W5100S+POE (5 pins)
GND: PICO,LCD (86 pins), W5100S+POE (60 pins)
VBUS: PICO,LCD (20 pins), W5100S+POE (J12.1 R130.2 R136.1 U3.40)
VSYS: PICO,LCD (C1.2 U1.3), W5100S+POE (D13.2 J12.2 U3.39)
GPIO5: PICO,LCD (P1.8), W5100S+POE (J11.7 U3.7)
GPIO10: PICO,LCD (P1.7), W5100S+POE (J11.14 U3.14)
GPIO11: PICO,LCD (P1.6), W5100S+POE (J11.15 U3.15)
GPIO12: PICO,LCD (P1.9), W5100S+POE (J11.16 U3.16)
GPIO13: PICO,LCD (P1.3 R91.1), W5100S+POE (J11.17 U3.17)
GPIO14: PICO,LCD (P1.5), W5100S+POE (J11.19 U3.19)
GPIO15: PICO,LCD (P1.4 R92.1), W5100S+POE (J11.20 U3.20)
GPIO26/ADC0: PICO,LCD (10 pins), W5100S+POE (J12.10 R133.1 U3.31)
GPIO27/ADC1: PICO,LCD (10 pins), W5100S+POE (J12.9 R132.1 U3.32)